# Altium schematic sheet FPGA.SchDoc: FPGA
size A3; Author: M.Beldyga; CompanyName: WUT ISE; DrawnBy: M.Beldyga; Organization: WUT ISE; Address1: PW ISE; Address2: Nowowiejska 15/19 00-665 Warsaw; Address3: micbeldyga@gmail.com; SheetNumber: 4; SheetTotal: 9; ModifiedBy: -; CheckedDate: -; DivGrp: WUT ISE; Designer: M.Beldyga; ModifiedDate: -; ProjectName: Sensor Box
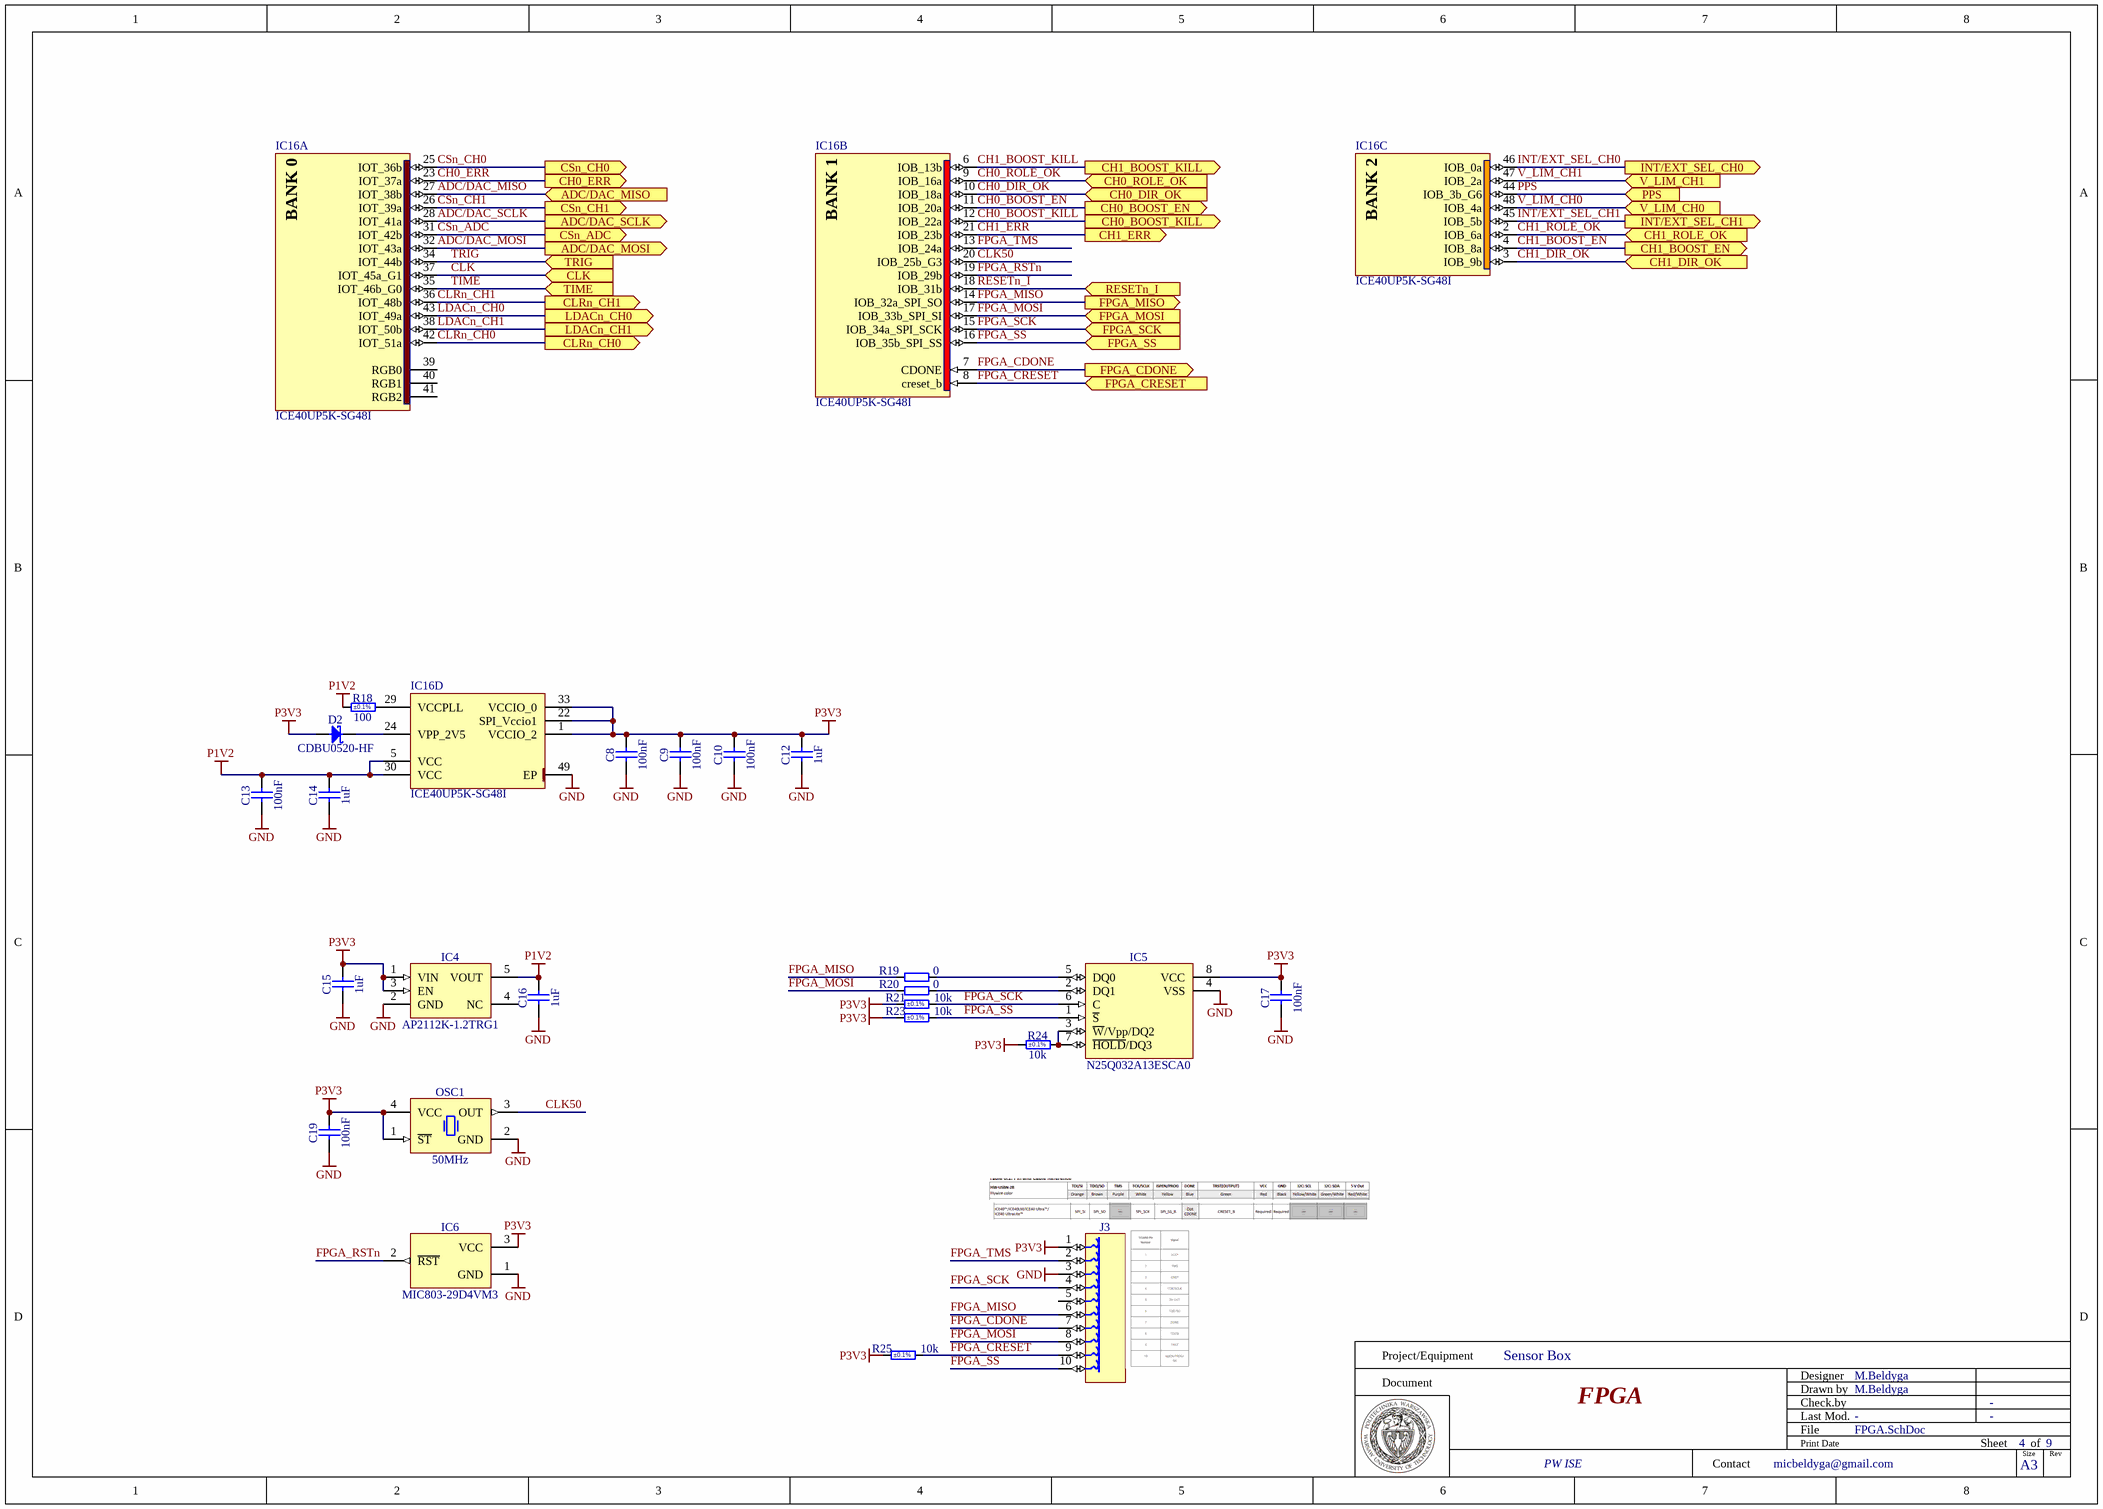
[diagram p0: FPGA.SchDoc]

## Parts
C8  100nF  [CAPC1005X55N]
C9  100nF  [CAPC1005X55N]
C10  100nF  [CAPC1005X55N]
C12  1uF  [CAPC1005X55N]
C13  100nF  [CAPC1005X55N]
C14  1uF  [CAPC1005X55N]
C15  1uF  [CAPC1005X55N]
C16  1uF  [CAPC1005X55N]
C17  100nF  [CAPC1005X55N]
C19  100nF  [CAPC1005X55N]
D2  CDBU0520-HF  [SOD-523F]
IC4  AP2112K-1.2TRG1  [SOT95P285X140-5N]
IC5  N25Q032A13ESCA0  [SOIC127P600X175-8N]
IC6  MIC803-29D4VM3  [SOT95P237X112-3N]
IC16  ICE40UP5K-SG48I  [QFN50P700X700X100-49N-S550]  (parts A,B,C,D of 4)
J3  TC2050-IDC  [TC2050-IDC]  (value not drawn)
OSC1  50MHz  [OSC_EPSON_SG-310]
R18  100  Tolerance: ±0.1%  [RESC1005X35N]
R19  0  [RESC1005X40N]
R20  0  [RESC1005X40N]
R21  10k  Tolerance: ±0.1%  [RESC1005X35N]
R23  10k  Tolerance: ±0.1%  [RESC1005X35N]
R24  10k  Tolerance: ±0.1%  [RESC1005X35N]
R25  10k  Tolerance: ±0.1%  [RESC1005X35N]

## Ports
ADC/DAC_MISO (in), ADC/DAC_MOSI (out), ADC/DAC_SCLK (out), CH0_BOOST_EN (out), CH0_BOOST_KILL (out), CH0_DIR_OK (in), CH0_ERR (out), CH0_ROLE_OK (in), CH1_BOOST_EN (out), CH1_BOOST_KILL (out), CH1_DIR_OK (in), CH1_ERR (out), CH1_ROLE_OK (in), CLK (in), CLRn_CH0 (out), CLRn_CH1 (out), CSn_ADC (out), CSn_CH0 (out), CSn_CH1 (out), FPGA_CDONE (out), FPGA_CRESET (in), FPGA_MISO (out), FPGA_MOSI (in), FPGA_SCK (in), FPGA_SS (in), INT/EXT_SEL_CH0 (out), INT/EXT_SEL_CH1 (out), LDACn_CH0 (out), LDACn_CH1 (out), PPS (in), RESETn_I (in), TIME (in), TRIG (in), V_LIM_CH0 (in), V_LIM_CH1 (in)

## Nets
GND: C8.1 C9.1 C10.1 C12.1 C13.1 C14.1 C15.1 C16.1 C17.1 C19.1 IC4.2(GND) IC5.4(VSS) IC6.1(GND) IC16.49(EP) J3.3 OSC1.2(GND)
P1V2: C13.2 C14.2 C16.2 IC4.5(VOUT) IC16.5(VCC) IC16.30(VCC) R18.1
P3V3: C8.2 C9.2 C10.2 C12.2 C15.2 C17.2 C19.2 D2.2(A) IC4.1(VIN) IC4.3(EN) IC5.8(VCC) IC6.3(VCC) IC16.1(VCCIO_2) IC16.22(SPI_Vccio1) IC16.33(VCCIO_0) J3.1 OSC1.1(~{ST}) OSC1.4(VCC) R21.1 R23.1 R24.1 R25.1
ADC/DAC_MISO: IC16.27(IOT_38b) ; port ADC/DAC_MISO
ADC/DAC_MOSI: IC16.32(IOT_43a) ; port ADC/DAC_MOSI
ADC/DAC_SCLK: IC16.28(IOT_41a) ; port ADC/DAC_SCLK
CH0_BOOST_EN: IC16.11(IOB_20a) ; port CH0_BOOST_EN
CH0_BOOST_KILL: IC16.12(IOB_22a) ; port CH0_BOOST_KILL
CH0_DIR_OK: IC16.10(IOB_18a) ; port CH0_DIR_OK
CH0_ERR: IC16.23(IOT_37a) ; port CH0_ERR
CH0_ROLE_OK: IC16.9(IOB_16a) ; port CH0_ROLE_OK
CH1_BOOST_EN: IC16.4(IOB_8a) ; port CH1_BOOST_EN
CH1_BOOST_KILL: IC16.6(IOB_13b) ; port CH1_BOOST_KILL
CH1_DIR_OK: IC16.3(IOB_9b) ; port CH1_DIR_OK
CH1_ERR: IC16.21(IOB_23b) ; port CH1_ERR
CH1_ROLE_OK: IC16.2(IOB_6a) ; port CH1_ROLE_OK
CLK: IC16.37(IOT_45a_G1) ; port CLK
CLK50: IC16.20(IOB_25b_G3) OSC1.3(OUT)
CLRn_CH0: IC16.42(IOT_51a) ; port CLRn_CH0
CLRn_CH1: IC16.36(IOT_48b) ; port CLRn_CH1
CSn_ADC: IC16.31(IOT_42b) ; port CSn_ADC
CSn_CH0: IC16.25(IOT_36b) ; port CSn_CH0
CSn_CH1: IC16.26(IOT_39a) ; port CSn_CH1
FPGA_CDONE: IC16.7(CDONE) J3.7 ; port FPGA_CDONE
FPGA_CRESET: IC16.8(creset_b) J3.9 R25.2 ; port FPGA_CRESET
FPGA_MISO: IC16.14(IOB_32a_SPI_SO) J3.6 R19.1 ; port FPGA_MISO
FPGA_MOSI: IC16.17(IOB_33b_SPI_SI) J3.8 R20.1 ; port FPGA_MOSI
FPGA_RSTn: IC6.2(~{RST}) IC16.19(IOB_29b)
FPGA_SCK: IC5.6(C) IC16.15(IOB_34a_SPI_SCK) J3.4 R21.2 ; port FPGA_SCK
FPGA_SS: IC5.1(~{S}) IC16.16(IOB_35b_SPI_SS) J3.10 R23.2 ; port FPGA_SS
FPGA_TMS: IC16.13(IOB_24a) J3.2
INT/EXT_SEL_CH0: IC16.46(IOB_0a) ; port INT/EXT_SEL_CH0
INT/EXT_SEL_CH1: IC16.45(IOB_5b) ; port INT/EXT_SEL_CH1
LDACn_CH0: IC16.43(IOT_49a) ; port LDACn_CH0
LDACn_CH1: IC16.38(IOT_50b) ; port LDACn_CH1
PPS: IC16.44(IOB_3b_G6) ; port PPS
RESETn_I: IC16.18(IOB_31b) ; port RESETn_I
TIME: IC16.35(IOT_46b_G0) ; port TIME
TRIG: IC16.34(IOT_44b) ; port TRIG
V_LIM_CH0: IC16.48(IOB_4a) ; port V_LIM_CH0
V_LIM_CH1: IC16.47(IOB_2a) ; port V_LIM_CH1
NetD2_1: D2.1(C) IC16.24(VPP_2V5)
NetIC5_2: IC5.2(DQ1) R20.2
NetIC5_3: IC5.3(~{W}/Vpp/DQ2) IC5.7(~{HOLD}/DQ3) R24.2
NetIC5_5: IC5.5(DQ0) R19.2
NetIC16_29: IC16.29(VCCPLL) R18.2

Not connected (* = marked no-connect by the designer): IC4 4(NC); IC16 39(RGB0) 40(RGB1) 41(RGB2); J3 5

## Notes on the sheet
- Project/Equipment
- Document
- Designer
- Drawn by
- Check.by
- Contact
- File
- Last Mod.
- Print Date
- Sheet
- Size
- A3
- of
- Rev
- (in symbol ICE40UP5K-SG48I, part A) BANK 0
- (in symbol ICE40UP5K-SG48I, part B) BANK 1
- (in symbol ICE40UP5K-SG48I, part C) BANK 2

## Library data of the parts
C8-C10 C13 C17 C19 = CC0402_100NF_16V_10%_X7R: Non-polarised capacitor; Part Description: SMD Multilayer Chip Ceramic Capacitor; Manufacturer: GENERIC; Manufacturer1 Part Number: GRM155R71C104KA88D; Voltage: 16V; TC: X7R; Tolerance: ±10%; Part Number: CC0402_100NF_16V_10%_X7R; Component Kind: Standard; Component Type: Standard; Pin Count: 2; Value: 100nF; Status: Not Recommended; Manufacturer Part Number: CC0402_100NF_16V_10%_X7R; Case: 0402; Mounted: Yes; Socket: No; SMD: Yes; Sense: No; Manufacturer1 Example: MURATA; Manufacturer1 ComponentHeight: 0.55mm; HelpURL: \\cern.ch\dfs\Applications\Altium\Datasheets\CC0402_X7R_MURATA_GRM.pdf; Author: CERN DEM JLC; CreateDate: 05.12.2013; LatestRevisionDate: 03.12.2007
C12 C14-C16 = CC0402_1UF_16V_10%_X5R: Non-polarised capacitor; Part Description: SMD Multilayer Chip Ceramic Capacitor; Manufacturer: GENERIC; Manufacturer1 Part Number: C1005X5R1C105KT; Voltage: 16V; TC: X5R; Tolerance: ±10%; Part Number: CC0402_1UF_16V_10%_X5R; Component Kind: Standard; Component Type: Standard; Pin Count: 2; Value: 1uF; Status: Preferred; Manufacturer Part Number: CC0402_1UF_16V_10%_X5R; Case: 0402; Mounted: Yes; Socket: No; SMD: Yes; Sense: No; Manufacturer1 Example: TDK; Manufacturer1 ComponentHeight: 0.55mm; HelpURL: \\cern.ch\dfs\Applications\Altium\Datasheets\CC0402_X5R_TDK_C.pdf; Author: CERN DEM JLC; CreateDate: 25.10.2012; LatestRevisionDate: 25.10.2012
D2 = CDBU0520-HF: Schottky Diode; Part Description: 20V Surface mount Schottky Barrier Diode; Manufacturer: COMCHIP; Voltage: 20V; Power: 500mA; PressFit: No; Bonding: No; Part Number: CDBU0520-HF; Component Kind: Standard; Component Type: Standard; Device: CDBU0520-HF; PackageDescription: Small Outline Diode Flat Lead (SOD-523F), Body; 1.80mm L X 1mm W X 0.85mm H; Manufacturer Part Number: CDBU0520-HF; Pin Count: 2; Case: SOD-523F; Mounted: Yes; Socket: No; SMD: Yes; Sense: No; ComponentHeight: 1mm; HelpURL: \\cern.ch\dfs\Applications\Altium\Datasheets\CDBU0520-HF.pdf; Author: CERN DEM HF; CreateDate: 13.10.2023; LatestRevisionDate: 13.10.2023
IC4 = REG_AP2112K-1.2: 600mA CMOS Low Dropout Linear Regulator with Enable; Part Description: 1.2V 600mA CMOS Low Dropout Linear Regulator with Enable; Manufacturer: DIODES INCORPORATED; PressFit: No; Bonding: No; Part Number: AP2112K-1.2TRG1; Component Kind: Standard; Component Type: Standard; Device: AP2112K-1.2TRG1; PackageDescription: SOT23, 0.95mm Pitch; 5 Pin, 1.6mm W X 3.0mm L X 1.40mm H body, IPC Medium Density; Manufacturer Part Number: AP2112K-1.2TRG1; Pin Count: 5; Case: SOT25; Mounted: Yes; Socket: No; SMD: Yes; Sense: No; ComponentHeight: 1.4mm; HelpURL: \\cern.ch\dfs\Applications\Altium\Datasheets\AP2112K-3.3TRG1.pdf; Author: GK; CreateDate: 13.12.2017; LatestRevisionDate: 27.06.2022
IC5 = N25Q032A13ESCA0: 32Mb, 3V, Multiple I/O Serial Flash Memory; Part Description: 32Mb, 2.7 to 3.6V, Multiple I/O Serial Flash Memory; Manufacturer: MICRON TECHNOLOGY; PressFit: No; Bonding: No; Part Number: N25Q032A13ESCA0; Component Kind: Standard; Component Type: Standard; Device: N25Q032A13ESCA0; PackageDescription: SOIC, 1.27mm Pitch; 8 Pin - Body 4x5mm, IPC Medium Density; Manufacturer Part Number: N25Q032A13ESCA0; Pin Count: 8; Case: SOIC8; Mounted: Yes; Socket: No; SMD: Yes; Sense: No; ComponentHeight: 1.75mm; HelpURL: \\cern.ch\dfs\Applications\Altium\Datasheets\N25Q032A13ESCA0.pdf; Author: CERN DEM HF; CreateDate: 09.12.2024; LatestRevisionDate: 09.12.2024
IC6 = MIC803-29D4VM3: 3.075V Microprocessor Supervisor Circuit With Open-Drain Reset Output; Part Description: 2.93V Microprocessor Supervisor Circuit with Open-Drain Reset Output; Manufacturer: MICROCHIP TECHNOLOGY; PressFit: No; Bonding: No; Part Number: MIC803-29D4VM3; Component Kind: Standard; Component Type: Standard; Device: MIC803-29D4VM3; PackageDescription: SOT, 0.95mm Pitch; 3 Pin, 1.30mm W X 2.92mm L X 1.12mm H body, IPC Medium Density; Manufacturer Part Number: MIC803-29D4VM3; Pin Count: 3; Case: SOT23-3; Mounted: Yes; Socket: No; SMD: Yes; Sense: No; ComponentHeight: 1.12mm; Author: CERN DEM BC; HelpURL: \\cern.ch\dfs\Applications\Altium\Datasheets\MIC803.pdf; CreateDate: 29.04.2020; LatestRevisionDate: 29.04.2020
IC16 = ICE40UP5K-SG48I: ICE40 Ultra FPGA, 3520 Logic Cells, 400 kHz Data Transfer Speed, 48 pin QFN; Part Description: ICE40 Ultra FPGA, 5280 Logic Cells, 400 kHz Data Transfer Speed, 48 pin QFN; Manufacturer: LATTICE SEMICONDUCTOR; PressFit: No; Bonding: No; Part Number: ICE40UP5K-SG48I; Component Kind: Standard; Component Type: Standard; Device: ICE40UP5K-SG48I; PackageDescription: QFN, 0.50mm Pitch, Square; 48 Pin, 7.00mm L X 7.00mm W X 1.00mm H body (w/Thermal Tab 5.50mm X 5.40mm), IPC Medium Density; Manufacturer Part Number: ICE40UP5K-SG48I; Pin Count: 49; Case: QFN48; Mounted: Yes; Socket: No; SMD: Yes; Sense: No; ComponentHeight: 1.00mm; HelpURL: \\cern.ch\dfs\Applications\Altium\Datasheets\ICE40UP5K.pdf; ComponentLink1URL: \\cern.ch\dfs\Applications\Altium\Datasheets\LATTICE_Packege.pdf; ComponentLink1Description: Package; ComponentLink2URL: \\cern.ch\dfs\Applications\Altium\Datasheets\ICE40UP5K_Pinout.xlsx; ComponentLink2Description: Pinout; Author: CERN DEM HF; CreateDate: 12/16/2024; LatestRevisionDate: 12/16/2024
J3 = TC2050-IDC: TC2030-MCP and TC2050-IDC Pad Contact; Part Description: 10 X 31mil Diameter SMD Pad For TC2050-IDC Legged Connector; Mounted: No; Part Number: TC2050-IDC; Component Kind: Standard (No BOM); Component Type: Standard (No BOM); Pin Count: 10; Family: TC2050-IDC; Socket: No; SMD: Yes; Sense: No; Status: None; ComponentHeight: 0mm; HelpURL: \\cern.ch\dfs\Applications\Altium\Datasheets\TC2050-IDC.pdf; Author: CERN DEM HF; CreateDate: 02.05.2024; LatestRevisionDate: 02.05.2024; PackageDescription: 10 X 31mil Diameter SMD Pad For TC2030-MCP Legged Connector
OSC1 = OSC_50MHZ_EPSON_SG-310SCN: Oscillator 4 pins 1=\ST 2=GND 3=OUT 4=VCC; Part Description: 3.3V, ±100ppm, 15pF -40..85°C, Stanby Function , Surface Mount Crystal Oscillator (SG-310 Series); Manufacturer: EPSON TOYOCOM; Manufacturer Part Number: SG-310 SCN 50.0000MJ; PressFit: No; Bonding: No; Part Number: OSC_50MHZ_EPSON_SG-310SCN; Component Kind: Standard; Component Type: Standard; PackageDescription: Oscillator, Corner Concave; 4 Pin, 2.5mm L X 3.2mm W X 1.2mm H; Value: 50MHz; Pin Count: 4; Mounted: Yes; Socket: No; SMD: Yes; Sense: No; ComponentHeight: 1.2mm; HelpURL: \\cern.ch\dfs\Applications\Altium\Datasheets\OSC_EPSON_SG-310.pdf; ComponentLink1URL: \\cern.ch\dfs\Applications\Altium\Datasheets\OSC_EPSON_SG-310_Ordering-Informations.pdf; ComponentLink1Description: Ordering Informations; Author: CERN DEM JLC; CreateDate: 31.03.2010; LatestRevisionDate: 31.03.2010
R18 = R0402_100R_0.1%_0.063W_25PPM: Resistor - 0.1%; Part Description: Thin Film Precision Resistor; Manufacturer: GENERIC; Manufacturer1 Part Number: CPF0402B100RE1; Power: 0.063W; TC: ±25ppm/°C; PressFit: No; Part Number: R0402_100R_0.1%_0.063W_25PPM; Component Kind: Standard; Component Type: Standard; Pin Count: 2; Value: 100; Status: Not Recommended; Manufacturer Part Number: R0402_100R_0.1%_0.063W_25PPM; Case: 0402; Mounted: Yes; Sense: No; Socket: No; SMD: Yes; Manufacturer1 Example: TE CONNECTIVITY; Manufacturer1 ComponentHeight: 0.35mm; HelpURL: \\cern.ch\dfs\Applications\Altium\Datasheets\R0402_TYCO_CPF.pdf; Author: CERN DEM JMW; CreateDate: 22.09.2015; LatestRevisionDate: 22.09.2015
R19 R20 = R0402_0R_JUMPER: Resistor; Part Description: 1A (0.05R Max DC Resistance) Zero Ohm Jumper; Manufacturer: GENERIC; Manufacturer1 Part Number: 232270591001L; PressFit: No; Part Number: R0402_0R_JUMPER; Component Kind: Standard; Component Type: Standard; Pin Count: 2; Value: 0; Status: Not Recommended; Manufacturer Part Number: R0402_0R_JUMPER; Case: 0402; Mounted: Yes; Sense: No; Socket: No; SMD: Yes; Manufacturer1 Example: YAGEO PHYCOMP; Manufacturer1 ComponentHeight: 0.4mm; HelpURL: \\cern.ch\dfs\Applications\Altium\Datasheets\R0402_Phycomp_RC0402.pdf; Author: CERN DEM JLC; CreateDate: 03.12.2007; LatestRevisionDate: 17.10.2012
R21 R23-R25 = R0402_10K_0.1%_0.063W_25PPM: Resistor - 0.1%; Part Description: Thin Film Precision Resistor; Manufacturer: GENERIC; Manufacturer1 Part Number: CPF0402B10KE1; Power: 0.063W; TC: ±25ppm/°C; PressFit: No; Part Number: R0402_10K_0.1%_0.063W_25PPM; Component Kind: Standard; Component Type: Standard; Pin Count: 2; Value: 10k; Status: Not Recommended; Manufacturer Part Number: R0402_10K_0.1%_0.063W_25PPM; Case: 0402; Mounted: Yes; Sense: No; Socket: No; SMD: Yes; Manufacturer1 Example: TE CONNECTIVITY; Manufacturer1 ComponentHeight: 0.35mm; HelpURL: \\cern.ch\dfs\Applications\Altium\Datasheets\R0402_TYCO_CPF.pdf; Author: CERN DEM JMW; CreateDate: 9/22/2015; LatestRevisionDate: 9/22/2015